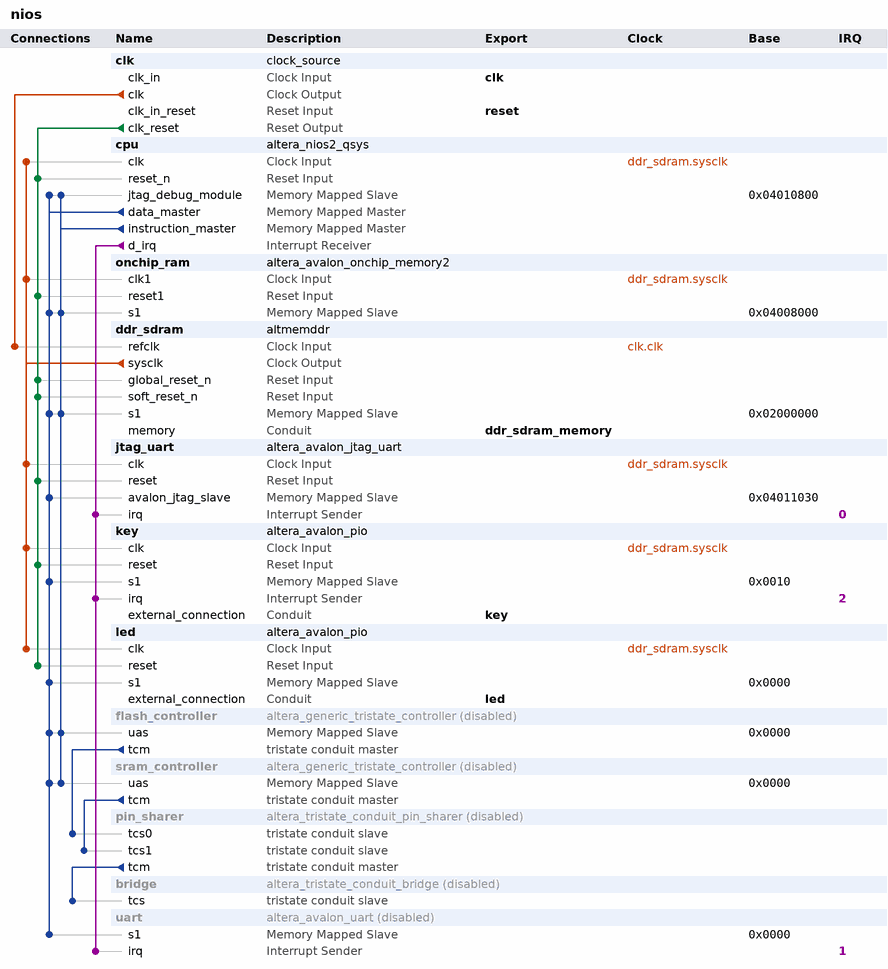
[diagram p0: system contents]
# Platform Designer (Qsys) system nios, Cyclone III EP3C25F324C6
# Parameters at their usual value, and those the tool derives, are not listed.
package require -exact qsys 13.1
create_system nios
set_project_property DEVICE_FAMILY {Cyclone III}
set_project_property DEVICE EP3C25F324C6

add_instance clk clock_source 13.1
set_instance_parameter_value clk clockFrequency 50000000

add_instance cpu altera_nios2_qsys 13.1
set_instance_parameter_value cpu resetSlave ddr_sdram.s1
set_instance_parameter_value cpu mmu_TLBMissExcSlave None
set_instance_parameter_value cpu exceptionSlave onchip_ram.s1
set_instance_parameter_value cpu breakSlave cpu.jtag_debug_module
set_instance_parameter_value cpu impl Tiny
set_instance_parameter_value cpu icache_size 4096

add_instance onchip_ram altera_avalon_onchip_memory2 13.1
set_instance_parameter_value onchip_ram dataWidth 32
set_instance_parameter_value onchip_ram dualPort false
set_instance_parameter_value onchip_ram initMemContent false
set_instance_parameter_value onchip_ram initializationFileName onchip_mem.hex
set_instance_parameter_value onchip_ram memorySize 20480

add_instance ddr_sdram altmemddr 13.1
set_instance_parameter_value ddr_sdram pipeline_commands false
set_instance_parameter_value ddr_sdram debug_en false
set_instance_parameter_value ddr_sdram export_debug_port false
set_instance_parameter_value ddr_sdram use_generated_memory_model true
set_instance_parameter_value ddr_sdram dedicated_memory_clk_phase_label {Dedicated memory clock phase:}
set_instance_parameter_value ddr_sdram mem_if_clk_mhz 100.0
set_instance_parameter_value ddr_sdram quartus_project_exists false
set_instance_parameter_value ddr_sdram local_if_drate Full
set_instance_parameter_value ddr_sdram enable_v72_rsu false
set_instance_parameter_value ddr_sdram local_if_clk_mhz_label 100.0
set_instance_parameter_value ddr_sdram new_variant true
set_instance_parameter_value ddr_sdram mem_if_memtype {DDR SDRAM}
set_instance_parameter_value ddr_sdram pll_ref_clk_mhz 50.0
set_instance_parameter_value ddr_sdram mem_if_clk_ps_label {(10000 ps)}
set_instance_parameter_value ddr_sdram family {Cyclone III}
set_instance_parameter_value ddr_sdram project_family {Cyclone III}
set_instance_parameter_value ddr_sdram speed_grade 6
set_instance_parameter_value ddr_sdram dedicated_memory_clk_phase 0
set_instance_parameter_value ddr_sdram pll_ref_clk_ps_label {(20000 ps)}
set_instance_parameter_value ddr_sdram avalon_burst_length 1
set_instance_parameter_value ddr_sdram mem_if_clk_pair_count 1
set_instance_parameter_value ddr_sdram mem_if_cs_per_dimm 1
set_instance_parameter_value ddr_sdram pre_latency_label {Fix read latency at:}
set_instance_parameter_value ddr_sdram dedicated_memory_clk_en false
set_instance_parameter_value ddr_sdram mirror_addressing 0
set_instance_parameter_value ddr_sdram mem_if_bankaddr_width 2
set_instance_parameter_value ddr_sdram register_control_word_9 0000
set_instance_parameter_value ddr_sdram mem_if_rowaddr_width 13
set_instance_parameter_value ddr_sdram mem_dyn_deskew_en false
set_instance_parameter_value ddr_sdram post_latency_label {cycles (0 cycles=minimum latency, non-deterministic)}
set_instance_parameter_value ddr_sdram mem_if_dm_pins_en Yes
set_instance_parameter_value ddr_sdram local_if_dwidth_label 32
set_instance_parameter_value ddr_sdram register_control_word_7 0000
set_instance_parameter_value ddr_sdram register_control_word_8 0000
set_instance_parameter_value ddr_sdram mem_if_preset {Custom (PSC A2S56D40CTP-G5)}
set_instance_parameter_value ddr_sdram mem_if_pchaddr_bit 10
set_instance_parameter_value ddr_sdram WIDTH_RATIO 4
set_instance_parameter_value ddr_sdram vendor Other
set_instance_parameter_value ddr_sdram register_control_word_3 0000
set_instance_parameter_value ddr_sdram register_control_word_4 0000
set_instance_parameter_value ddr_sdram chip_or_dimm {Discrete Device}
set_instance_parameter_value ddr_sdram register_control_word_5 0000
set_instance_parameter_value ddr_sdram register_control_word_6 0000
set_instance_parameter_value ddr_sdram mem_fmax 200.0
set_instance_parameter_value ddr_sdram register_control_word_0 0000
set_instance_parameter_value ddr_sdram register_control_word_size 4
set_instance_parameter_value ddr_sdram register_control_word_1 0000
set_instance_parameter_value ddr_sdram register_control_word_2 0000
set_instance_parameter_value ddr_sdram register_control_word_11 0000
set_instance_parameter_value ddr_sdram register_control_word_10 0000
set_instance_parameter_value ddr_sdram mem_if_cs_width 1
set_instance_parameter_value ddr_sdram mem_if_preset_rlat 0
set_instance_parameter_value ddr_sdram mem_if_cs_per_rank 1
set_instance_parameter_value ddr_sdram fast_simulation_en FAST
set_instance_parameter_value ddr_sdram register_control_word_15 0000
set_instance_parameter_value ddr_sdram register_control_word_14 0000
set_instance_parameter_value ddr_sdram mem_if_dwidth 16
set_instance_parameter_value ddr_sdram mem_if_dq_per_dqs 8
set_instance_parameter_value ddr_sdram mem_if_coladdr_width 9
set_instance_parameter_value ddr_sdram register_control_word_13 0000
set_instance_parameter_value ddr_sdram register_control_word_12 0000
set_instance_parameter_value ddr_sdram mem_tiha_ps 600
set_instance_parameter_value ddr_sdram mem_tdsh_ck 0.2
set_instance_parameter_value ddr_sdram mem_if_trfc_ns 70.0
set_instance_parameter_value ddr_sdram mem_tqh_ck 0.36
set_instance_parameter_value ddr_sdram mem_tisa_ps 600
set_instance_parameter_value ddr_sdram mem_tdss_ck 0.2
set_instance_parameter_value ddr_sdram mem_trtp_ns 0.0
set_instance_parameter_value ddr_sdram mem_if_tinit_us 200.0
set_instance_parameter_value ddr_sdram mem_if_trcd_ns 15.0
set_instance_parameter_value ddr_sdram mem_if_twtr_ck 2
set_instance_parameter_value ddr_sdram mem_trrd_ns 11.0
set_instance_parameter_value ddr_sdram mem_tdqss_ck 0.28
set_instance_parameter_value ddr_sdram mem_tqhs_ps 500
set_instance_parameter_value ddr_sdram mem_tdsa_ps 400
set_instance_parameter_value ddr_sdram mem_tac_ps 700
set_instance_parameter_value ddr_sdram mem_tdha_ps 400
set_instance_parameter_value ddr_sdram mem_if_tras_ns 40.0
set_instance_parameter_value ddr_sdram mem_if_twr_ns 15.0
set_instance_parameter_value ddr_sdram mem_tdqsck_ps 550
set_instance_parameter_value ddr_sdram mem_if_trp_ns 15.0
set_instance_parameter_value ddr_sdram mem_tdqsq_ps 400
set_instance_parameter_value ddr_sdram mem_if_tmrd_ns 10.0
set_instance_parameter_value ddr_sdram mem_tfaw_ns 0.0
set_instance_parameter_value ddr_sdram mem_if_trefi_us 7.0
set_instance_parameter_value ddr_sdram mem_tcl_40_fmax 533.0
set_instance_parameter_value ddr_sdram mem_odt Disabled
set_instance_parameter_value ddr_sdram mp_WLH_percent 0.6
set_instance_parameter_value ddr_sdram mem_drv_str Normal
set_instance_parameter_value ddr_sdram mp_DH_percent 0.5
set_instance_parameter_value ddr_sdram input_period 0
set_instance_parameter_value ddr_sdram mp_QH_percent 0.5
set_instance_parameter_value ddr_sdram mp_QHS_percent 0.5
set_instance_parameter_value ddr_sdram mem_tcl_30_fmax 200.0
set_instance_parameter_value ddr_sdram ac_clk_select 90
set_instance_parameter_value ddr_sdram mp_DQSQ_percent 0.65
set_instance_parameter_value ddr_sdram mp_DS_percent 0.6
set_instance_parameter_value ddr_sdram pll_reconfig_ports_en false
set_instance_parameter_value ddr_sdram mem_btype Interleaved
set_instance_parameter_value ddr_sdram mp_IS_percent 0.7
set_instance_parameter_value ddr_sdram mem_tcl 3.0
set_instance_parameter_value ddr_sdram mp_DQSS_percent 0.5
set_instance_parameter_value ddr_sdram export_bank_info false
set_instance_parameter_value ddr_sdram mp_DSS_percent 0.6
set_instance_parameter_value ddr_sdram mem_dll_en Yes
set_instance_parameter_value ddr_sdram ac_phase 90
set_instance_parameter_value ddr_sdram mem_if_oct_en false
set_instance_parameter_value ddr_sdram mem_tcl_60_fmax 533.0
set_instance_parameter_value ddr_sdram mp_DSH_percent 0.6
set_instance_parameter_value ddr_sdram mem_if_dqsn_en false
set_instance_parameter_value ddr_sdram enable_mp_calibration true
set_instance_parameter_value ddr_sdram mp_IH_percent 0.6
set_instance_parameter_value ddr_sdram mem_tcl_15_fmax 533.0
set_instance_parameter_value ddr_sdram dll_external false
set_instance_parameter_value ddr_sdram mem_bl 4
set_instance_parameter_value ddr_sdram mp_WLS_percent 0.7
set_instance_parameter_value ddr_sdram mem_tcl_50_fmax 533.0
set_instance_parameter_value ddr_sdram mp_DQSCK_percent 0.5
set_instance_parameter_value ddr_sdram mem_tcl_25_fmax 200.0
set_instance_parameter_value ddr_sdram mem_tcl_20_fmax 133.333
set_instance_parameter_value ddr_sdram cfg_reorder_data false
set_instance_parameter_value ddr_sdram ctl_ecc_en false
set_instance_parameter_value ddr_sdram ctl_hrb_en false
set_instance_parameter_value ddr_sdram ref_clk_source clk
set_instance_parameter_value ddr_sdram cfg_data_reordering_type INTER_BANK
set_instance_parameter_value ddr_sdram ctl_powerdn_en false
set_instance_parameter_value ddr_sdram multicast_wr_en false
set_instance_parameter_value ddr_sdram auto_powerdn_cycles 0
set_instance_parameter_value ddr_sdram ctl_self_refresh_en false
set_instance_parameter_value ddr_sdram cfg_starve_limit 10
set_instance_parameter_value ddr_sdram ctl_latency 0
set_instance_parameter_value ddr_sdram tool_context SOPC_BUILDER
set_instance_parameter_value ddr_sdram mem_addr_mapping CHIP_ROW_BANK_COL
set_instance_parameter_value ddr_sdram burst_merge_en false
set_instance_parameter_value ddr_sdram user_refresh_en false
set_instance_parameter_value ddr_sdram qsys_mode true
set_instance_parameter_value ddr_sdram clk_source_sharing_en false
set_instance_parameter_value ddr_sdram ctl_lookahead_depth 4
set_instance_parameter_value ddr_sdram ctl_autopch_en false
set_instance_parameter_value ddr_sdram ctl_dynamic_bank_allocation false
set_instance_parameter_value ddr_sdram ctl_dynamic_bank_num 4
set_instance_parameter_value ddr_sdram local_if_type_avalon true
set_instance_parameter_value ddr_sdram csr_en false
set_instance_parameter_value ddr_sdram ctl_auto_correct_en false
set_instance_parameter_value ddr_sdram auto_powerdn_en false
set_instance_parameter_value ddr_sdram phy_if_type_afi true
set_instance_parameter_value ddr_sdram controller_type ngv110_ctl
set_instance_parameter_value ddr_sdram max_local_size 1
set_instance_parameter_value ddr_sdram mem_srtr Normal
set_instance_parameter_value ddr_sdram mem_mpr_loc {Predefined Pattern}
set_instance_parameter_value ddr_sdram dss_tinit_rst_us 200.0
set_instance_parameter_value ddr_sdram mem_tcl_90_fmax 400.0
set_instance_parameter_value ddr_sdram mem_rtt_wr {Dynamic ODT off}
set_instance_parameter_value ddr_sdram mem_tcl_100_fmax 400.0
set_instance_parameter_value ddr_sdram mem_pasr {Full Array}
set_instance_parameter_value ddr_sdram mem_asrm {Manual SR Reference (SRT)}
set_instance_parameter_value ddr_sdram mem_mpr_oper {Predefined Pattern}
set_instance_parameter_value ddr_sdram mem_tcl_80_fmax 400.0
set_instance_parameter_value ddr_sdram mem_drv_impedance RZQ/7
set_instance_parameter_value ddr_sdram mem_rtt_nom {ODT Disabled}
set_instance_parameter_value ddr_sdram mem_tcl_70_fmax 400.0
set_instance_parameter_value ddr_sdram mem_wtcl 5.0
set_instance_parameter_value ddr_sdram mem_dll_pch {Fast Exit}
set_instance_parameter_value ddr_sdram mem_atcl Disabled
set_instance_parameter_value ddr_sdram board_settings_valid true
set_instance_parameter_value ddr_sdram t_IH 0.6
set_instance_parameter_value ddr_sdram board_intra_DQS_group_skew 0.02
set_instance_parameter_value ddr_sdram isi_DQS 0.0
set_instance_parameter_value ddr_sdram addr_cmd_slew_rate 1.0
set_instance_parameter_value ddr_sdram board_tpd_inter_DIMM 0.05
set_instance_parameter_value ddr_sdram board_addresscmd_CK_skew 0.0
set_instance_parameter_value ddr_sdram t_DS_calculated 0.400
set_instance_parameter_value ddr_sdram isi_addresscmd_hold 0.0
set_instance_parameter_value ddr_sdram t_IS 0.6
set_instance_parameter_value ddr_sdram restore_default_toggle true
set_instance_parameter_value ddr_sdram dqs_dqsn_slew_rate 2.0
set_instance_parameter_value ddr_sdram dq_slew_rate 1.0
set_instance_parameter_value ddr_sdram board_inter_DQS_group_skew 0.02
set_instance_parameter_value ddr_sdram isi_addresscmd_setup 0.0
set_instance_parameter_value ddr_sdram board_minCK_DQS_skew -0.01
set_instance_parameter_value ddr_sdram t_IS_calculated 0.600
set_instance_parameter_value ddr_sdram num_slots_or_devices 1
set_instance_parameter_value ddr_sdram board_maxCK_DQS_skew 0.01
set_instance_parameter_value ddr_sdram board_skew_ps 20
set_instance_parameter_value ddr_sdram t_DH 0.4
set_instance_parameter_value ddr_sdram ck_ckn_slew_rate 2.0
set_instance_parameter_value ddr_sdram isi_DQ 0.0
set_instance_parameter_value ddr_sdram t_IH_calculated 0.600
set_instance_parameter_value ddr_sdram t_DH_calculated 0.400
set_instance_parameter_value ddr_sdram t_DS 0.4

add_instance jtag_uart altera_avalon_jtag_uart 13.1
set_instance_parameter_value jtag_uart simInteractiveOptions NO_INTERACTIVE_WINDOWS

add_instance key altera_avalon_pio 13.1
set_instance_parameter_value key captureEdge true
set_instance_parameter_value key direction Input
set_instance_parameter_value key edgeType FALLING
set_instance_parameter_value key generateIRQ true
set_instance_parameter_value key irqType EDGE
set_instance_parameter_value key width 1

add_instance led altera_avalon_pio 13.1
set_instance_parameter_value led bitClearingEdgeCapReg true
set_instance_parameter_value led captureEdge true
set_instance_parameter_value led direction Output
set_instance_parameter_value led edgeType FALLING
set_instance_parameter_value led generateIRQ true
set_instance_parameter_value led irqType EDGE
set_instance_parameter_value led width 1

add_instance flash_controller altera_generic_tristate_controller 13.1
set_instance_property flash_controller ENABLED false
set_instance_parameter_value flash_controller TCM_ADDRESS_W 24
set_instance_parameter_value flash_controller TCM_DATA_W 16
set_instance_parameter_value flash_controller TCM_BYTEENABLE_W 2
set_instance_parameter_value flash_controller TCM_READ_WAIT 100
set_instance_parameter_value flash_controller TCM_WRITE_WAIT 100
set_instance_parameter_value flash_controller TCM_SETUP_WAIT 60
set_instance_parameter_value flash_controller TCM_DATA_HOLD 20
set_instance_parameter_value flash_controller TCM_MAX_PENDING_READ_TRANSACTIONS 3
set_instance_parameter_value flash_controller TCM_TURNAROUND_TIME 2
set_instance_parameter_value flash_controller TCM_TIMING_UNITS 0
set_instance_parameter_value flash_controller TCM_READLATENCY 2
set_instance_parameter_value flash_controller TCM_SYMBOLS_PER_WORD 2
set_instance_parameter_value flash_controller USE_READ 1
set_instance_parameter_value flash_controller USE_BEGINTRANSFER 0
set_instance_parameter_value flash_controller USE_BYTEENABLE 0
set_instance_parameter_value flash_controller USE_OUTPUTENABLE 0
set_instance_parameter_value flash_controller ACTIVE_LOW_READ 1
set_instance_parameter_value flash_controller ACTIVE_LOW_BYTEENABLE 0
set_instance_parameter_value flash_controller ACTIVE_LOW_OUTPUTENABLE 0
set_instance_parameter_value flash_controller ACTIVE_LOW_BEGINTRANSFER 0
set_instance_parameter_value flash_controller CHIPSELECT_THROUGH_READLATENCY 0
set_instance_parameter_value flash_controller MODULE_ASSIGNMENT_KEYS embeddedsw.configuration.hwClassnameDriverSupportList,embeddedsw.configuration.hwClassnameDriverSupportDefault,embeddedsw.CMacro.SETUP_VALUE,embeddedsw.CMacro.WAIT_VALUE,embeddedsw.CMacro.HOLD_VALUE,embeddedsw.CMacro.TIMING_UNITS,embeddedsw.CMacro.SIZE,embeddedsw.memoryInfo.MEM_INIT_DATA_WIDTH,embeddedsw.memoryInfo.HAS_BYTE_LANE,embeddedsw.memoryInfo.IS_FLASH,embeddedsw.memoryInfo.GENERATE_DAT_SYM,embeddedsw.memoryInfo.GENERATE_FLASH,embeddedsw.memoryInfo.DAT_SYM_INSTALL_DIR,embeddedsw.memoryInfo.FLASH_INSTALL_DIR
set_instance_parameter_value flash_controller MODULE_ASSIGNMENT_VALUES altera_avalon_lan91c111:altera_avalon_cfi_flash,altera_avalon_cfi_flash,60,100,20,ns,16777216u,16,1,1,1,1,SIM_DIR,APP_DIR
set_instance_parameter_value flash_controller INTERFACE_ASSIGNMENT_KEYS embeddedsw.configuration.isFlash,embeddedsw.configuration.isMemoryDevice,embeddedsw.configuration.isNonVolatileStorage
set_instance_parameter_value flash_controller INTERFACE_ASSIGNMENT_VALUES 1,1,1

add_instance sram_controller altera_generic_tristate_controller 13.1
set_instance_property sram_controller ENABLED false
set_instance_parameter_value sram_controller TCM_ADDRESS_W 20
set_instance_parameter_value sram_controller TCM_DATA_W 32
set_instance_parameter_value sram_controller TCM_BYTEENABLE_W 4
set_instance_parameter_value sram_controller TCM_READ_WAIT 0
set_instance_parameter_value sram_controller TCM_WRITE_WAIT 0
set_instance_parameter_value sram_controller TCM_SETUP_WAIT 0
set_instance_parameter_value sram_controller TCM_DATA_HOLD 0
set_instance_parameter_value sram_controller TCM_MAX_PENDING_READ_TRANSACTIONS 5
set_instance_parameter_value sram_controller TCM_TURNAROUND_TIME 2
set_instance_parameter_value sram_controller TCM_TIMING_UNITS 1
set_instance_parameter_value sram_controller TCM_READLATENCY 4
set_instance_parameter_value sram_controller TCM_SYMBOLS_PER_WORD 4
set_instance_parameter_value sram_controller USE_READ 0
set_instance_parameter_value sram_controller USE_BEGINTRANSFER 1
set_instance_parameter_value sram_controller USE_BYTEENABLE 1
set_instance_parameter_value sram_controller USE_OUTPUTENABLE 1
set_instance_parameter_value sram_controller USE_RESET_OUTPUT 1
set_instance_parameter_value sram_controller ACTIVE_LOW_READ 0
set_instance_parameter_value sram_controller ACTIVE_LOW_BYTEENABLE 1
set_instance_parameter_value sram_controller ACTIVE_LOW_OUTPUTENABLE 1
set_instance_parameter_value sram_controller ACTIVE_LOW_BEGINTRANSFER 1
set_instance_parameter_value sram_controller ACTIVE_LOW_RESET_OUTPUT 1
set_instance_parameter_value sram_controller CHIPSELECT_THROUGH_READLATENCY 1
set_instance_parameter_value sram_controller MODULE_ASSIGNMENT_KEYS embeddedsw.configuration.hwClassnameDriverSupportList,embeddedsw.CMacro.SRAM_MEMORY_SIZE,embeddedsw.CMacro.SRAM_MEMORY_UNITS,embeddedsw.CMacro.SSRAM_DATA_WIDTH,embeddedsw.CMacro.SSRAM_READ_LATENCY,embeddedsw.memoryInfo.MEM_INIT_DATA_WIDTH,embeddedsw.memoryInfo.HAS_BYTE_LANE,embeddedsw.memoryInfo.GENERATE_DAT_SYM,embeddedsw.memoryInfo.DAT_SYM_INSTALL_DIR
set_instance_parameter_value sram_controller MODULE_ASSIGNMENT_VALUES altera_avalon_lan91c111:altera_avalon_cfi_flash,2,524288,32,2,32,1,1,SIM_DIR
set_instance_parameter_value sram_controller INTERFACE_ASSIGNMENT_KEYS embeddedsw.configuration.isMemoryDevice
set_instance_parameter_value sram_controller INTERFACE_ASSIGNMENT_VALUES 1

add_instance pin_sharer altera_tristate_conduit_pin_sharer 13.1
set_instance_property pin_sharer ENABLED false
set_instance_parameter_value pin_sharer NUM_INTERFACES 2

add_instance bridge altera_tristate_conduit_bridge 13.1
set_instance_property bridge ENABLED false

add_instance uart altera_avalon_uart 13.1
set_instance_property uart ENABLED false
set_instance_parameter_value uart baud 115200
set_instance_parameter_value uart dataBits 8
set_instance_parameter_value uart fixedBaud true
set_instance_parameter_value uart parity NONE
set_instance_parameter_value uart stopBits 1

# connections
add_connection clk.clk ddr_sdram.refclk clock
add_connection ddr_sdram.sysclk cpu.clk clock
add_connection ddr_sdram.sysclk jtag_uart.clk clock
add_connection ddr_sdram.sysclk key.clk clock
add_connection ddr_sdram.sysclk led.clk clock
add_connection ddr_sdram.sysclk onchip_ram.clk1 clock
add_connection clk.clk_reset cpu.reset_n reset
add_connection clk.clk_reset ddr_sdram.global_reset_n reset
add_connection clk.clk_reset ddr_sdram.soft_reset_n reset
add_connection clk.clk_reset jtag_uart.reset reset
add_connection clk.clk_reset key.reset reset
add_connection clk.clk_reset led.reset reset
add_connection clk.clk_reset onchip_ram.reset1 reset
add_connection cpu.data_master cpu.jtag_debug_module avalon
set_connection_parameter_value cpu.data_master/cpu.jtag_debug_module baseAddress 0x04010800
add_connection cpu.data_master ddr_sdram.s1 avalon
set_connection_parameter_value cpu.data_master/ddr_sdram.s1 baseAddress 0x02000000
add_connection cpu.data_master flash_controller.uas avalon
set_connection_parameter_value cpu.data_master/flash_controller.uas baseAddress 0x0000
add_connection cpu.data_master jtag_uart.avalon_jtag_slave avalon
set_connection_parameter_value cpu.data_master/jtag_uart.avalon_jtag_slave baseAddress 0x04011030
add_connection cpu.data_master key.s1 avalon
set_connection_parameter_value cpu.data_master/key.s1 baseAddress 0x0010
add_connection cpu.data_master led.s1 avalon
set_connection_parameter_value cpu.data_master/led.s1 baseAddress 0x0000
add_connection cpu.data_master onchip_ram.s1 avalon
set_connection_parameter_value cpu.data_master/onchip_ram.s1 baseAddress 0x04008000
add_connection cpu.data_master sram_controller.uas avalon
set_connection_parameter_value cpu.data_master/sram_controller.uas baseAddress 0x0000
add_connection cpu.data_master uart.s1 avalon
set_connection_parameter_value cpu.data_master/uart.s1 baseAddress 0x0000
add_connection cpu.instruction_master cpu.jtag_debug_module avalon
set_connection_parameter_value cpu.instruction_master/cpu.jtag_debug_module baseAddress 0x04010800
add_connection cpu.instruction_master ddr_sdram.s1 avalon
set_connection_parameter_value cpu.instruction_master/ddr_sdram.s1 baseAddress 0x02000000
add_connection cpu.instruction_master flash_controller.uas avalon
set_connection_parameter_value cpu.instruction_master/flash_controller.uas baseAddress 0x0000
add_connection cpu.instruction_master onchip_ram.s1 avalon
set_connection_parameter_value cpu.instruction_master/onchip_ram.s1 baseAddress 0x04008000
add_connection cpu.instruction_master sram_controller.uas avalon
set_connection_parameter_value cpu.instruction_master/sram_controller.uas baseAddress 0x0000
add_connection cpu.d_irq jtag_uart.irq interrupt
set_connection_parameter_value cpu.d_irq/jtag_uart.irq irqNumber 0
add_connection cpu.d_irq key.irq interrupt
set_connection_parameter_value cpu.d_irq/key.irq irqNumber 2
add_connection cpu.d_irq uart.irq interrupt
set_connection_parameter_value cpu.d_irq/uart.irq irqNumber 1
add_connection flash_controller.tcm pin_sharer.tcs0 tristate_conduit
add_connection pin_sharer.tcm bridge.tcs tristate_conduit
add_connection sram_controller.tcm pin_sharer.tcs1 tristate_conduit

# exported interfaces
add_interface clk clock sink
set_interface_property clk EXPORT_OF clk.clk_in
add_interface ddr_sdram_memory conduit end
set_interface_property ddr_sdram_memory EXPORT_OF ddr_sdram.memory
add_interface key conduit end
set_interface_property key EXPORT_OF key.external_connection
add_interface reset reset sink
set_interface_property reset EXPORT_OF clk.clk_in_reset
add_interface led conduit end
set_interface_property led EXPORT_OF led.external_connection

set_interconnect_requirement {$system} qsys_mm.clockCrossingAdapter HANDSHAKE
set_interconnect_requirement {$system} qsys_mm.maxAdditionalLatency 1
set_interconnect_requirement {$system} qsys_mm.insertDefaultSlave false

save_system nios.qsys
